# Altium schematic sheet Sheet2.SchDoc
size A4; SheetNumber: 2; SheetTotal: 2
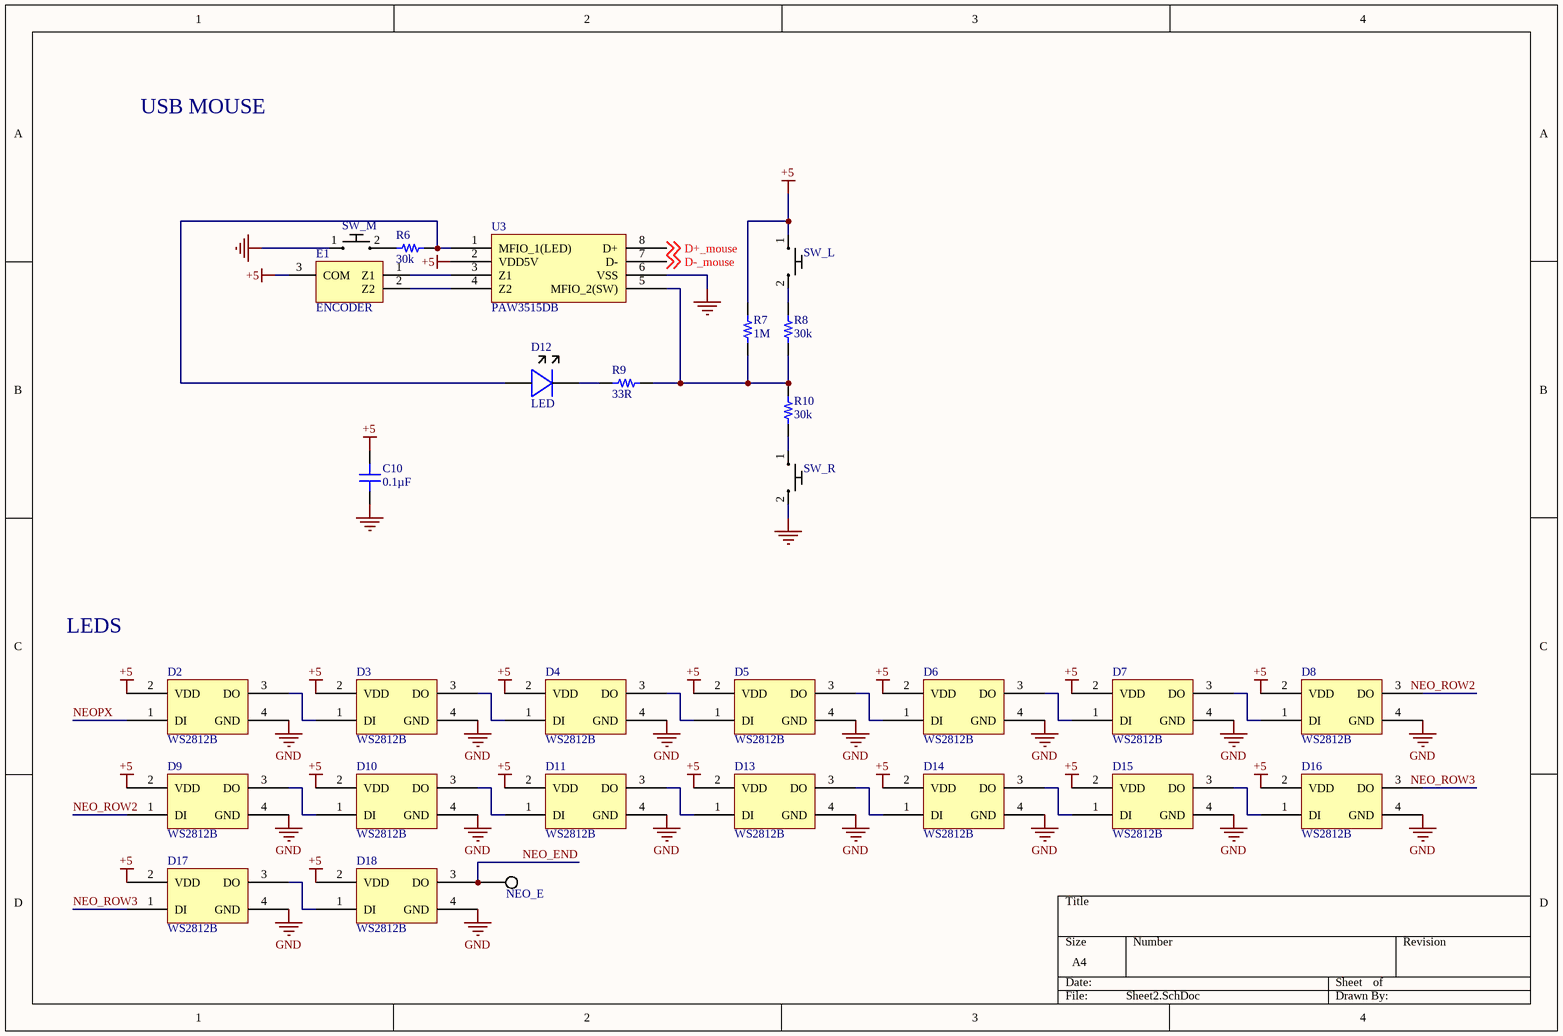
[diagram p0: Sheet2.SchDoc]

## Parts
C10  0.1µF  [CAP 0603_1608]
D2  WS2812B  [WS2812B4020]
D3  WS2812B  [WS2812B4020]
D4  WS2812B  [WS2812B4020]
D5  WS2812B  [WS2812B4020]
D6  WS2812B  [WS2812B4020]
D7  WS2812B  [WS2812B4020]
D8  WS2812B  [WS2812B4020]
D9  WS2812B  [WS2812B4020]
D10  WS2812B  [WS2812B4020]
D11  WS2812B  [WS2812B4020]
D12  LED  [MOUSE_LED]
D13  WS2812B  [WS2812B4020]
D14  WS2812B  [WS2812B4020]
D15  WS2812B  [WS2812B4020]
D16  WS2812B  [WS2812B4020]
D17  WS2812B  [WS2812B4020]
D18  WS2812B  [WS2812B4020]
E1  ENCODER  [TTC_ENCODER]
NEO_E  TestPoint  [TP2020]  (value not drawn)
R6  30k  [RES 0603_1608]
R7  1M  [RES 0603_1608]
R8  30k  [RES 0603_1608]
R9  33R  [RES 0603_1608]
R10  30k  [RES 0603_1608]
SW_L  SPST_BUTTON  [KailhBtn]  (value not drawn)
SW_M  SPST_BUTTON  [KailhBtn]  (value not drawn)
SW_R  SPST_BUTTON  [KailhBtn]  (value not drawn)
U3  PAW3515DB  [PAW3515DB]

## Nets
+5: C10.2 D2.2(VDD) D3.2(VDD) D4.2(VDD) D5.2(VDD) D6.2(VDD) D7.2(VDD) D8.2(VDD) D9.2(VDD) D10.2(VDD) D11.2(VDD) D13.2(VDD) D14.2(VDD) D15.2(VDD) D16.2(VDD) D17.2(VDD) D18.2(VDD) E1.3(COM) R7.2 SW_L.1 U3.2(VDD5V)
GND: C10.1 D2.4(GND) D3.4(GND) D4.4(GND) D5.4(GND) D6.4(GND) D7.4(GND) D8.4(GND) D9.4(GND) D10.4(GND) D11.4(GND) D13.4(GND) D14.4(GND) D15.4(GND) D16.4(GND) D17.4(GND) D18.4(GND) SW_M.1 SW_R.2 U3.6(VSS)
D+_mouse: U3.8(D+) ; off-sheet D+_mouse
D-_mouse: U3.7(D-) ; off-sheet D-_mouse
NEO_END: D18.3(DO) NEO_E.TP
NEO_ROW2: D8.3(DO) D9.1(DI)
NEO_ROW3: D16.3(DO) D17.1(DI)
NEOPX: D2.1(DI)
NetD2_3: D2.3(DO) D3.1(DI)
NetD3_3: D3.3(DO) D4.1(DI)
NetD4_3: D4.3(DO) D5.1(DI)
NetD5_3: D5.3(DO) D6.1(DI)
NetD6_3: D6.3(DO) D7.1(DI)
NetD7_3: D7.3(DO) D8.1(DI)
NetD9_3: D9.3(DO) D10.1(DI)
NetD10_3: D10.3(DO) D11.1(DI)
NetD11_3: D11.3(DO) D13.1(DI)
NetD12_A: D12.A R6.2 U3.1(MFIO_1(LED))
NetD12_K: D12.K R9.1
NetD13_3: D13.3(DO) D14.1(DI)
NetD14_3: D14.3(DO) D15.1(DI)
NetD15_3: D15.3(DO) D16.1(DI)
NetD17_3: D17.3(DO) D18.1(DI)
NetE1_1: E1.1(Z1) U3.3(Z1)
NetE1_2: E1.2(Z2) U3.4(Z2)
NetR6_1: R6.1 SW_M.2
NetR7_1: R7.1 R8.1 R9.2 R10.2 U3.5(MFIO_2(SW))
NetR8_2: R8.2 SW_L.2
NetR10_1: R10.1 SW_R.1

## Notes on the sheet
- USB MOUSE
- LEDS

## Library data of the parts
C10 = CAP-RTZP49: CAP CER SMD 0603 .1UF 10% X7R 25; Manufacturer: Samsung Electro-Mechanics; Rated Voltage: 50V; Part Number: CAP-RTZP49; SCH_Comment: 0.1µF; Value: 0.1µF; Tolerance: ±10%; Supplier 1: Digi-key; Supplier Part Number 1: 1276-CL10B104KB8NNNLCT-ND; JLC PartNumber: C14663; Size: 0603 (1608 Metric)
D2-D11 D13-D18 = DIO4020-RYIG4M: NEOPIXEL RGB LED; Manufacturer: Worldsemi; Part Number: DIO4020-RYIG4M; SCH_Comment: WS2812B; Supplier 1: LCSC; JLC PartNumber: C3647024; Supplier Part Number 1: C2761795
D12 = Optical mouse diode: Part Number: Optical mouse diode; SCH_Comment: Optical mouse diode
E1 = MouseEncoder: Mouse wheel encoder; SCH_Comment: MSENC; Part Number: MouseEncoder; Supplier 1: Aliexpress; Supplier Part Number 1: https://fr.aliexpress.com/item/1005007019311898.html
NEO_E = JMP-RTZL7I: PC TEST POINT MINIATURE; Manufacturer: Keystone Electronics; SCH_Comment: 5015 TestPoint; Part Number: JMP-RTZL7I; Supplier 1: DigiKey; Supplier Part Number 1: 36-5015TR-ND
R6 R8 R10 = ERJ-3EKF3002V: RES SMD 30K OHM 1% 1/10W 0603; Manufacturer: Panasonic Electronic Components; Power (Watts): 0.1W, 1/10W; Temperature Coefficient: ±100ppm/°C; Part Number: ERJ-3EKF3002V; SCH_Comment: 30k; Value: 30k; Tolerance: ±1%; Supplier 1: Digi-key; Supplier Part Number 1: P30.0KHCT-ND; Composition: Thick Film; Features: Automotive AEC-Q200; Operating Temperature: -55°C ~ 155°C; Size: 0603 (1608 Metric)
R7 = ERJ-3EKF1004V: RES SMD 1M OHM 1% 1/10W 0603; Manufacturer: Panasonic Electronic Components; Power (Watts): 0.1W, 1/10W; Temperature Coefficient: ±100ppm/°C; Part Number: ERJ-3EKF1004V; SCH_Comment: 1M; Value: 1M; Tolerance: ±1%; Supplier 1: Digi-key; Supplier Part Number 1: P1.00MHCT-ND; Composition: Thick Film; Features: Automotive AEC-Q200; Operating Temperature: -55°C ~ 155°C; Size: 0603 (1608 Metric)
R9 = ERJ-3EKF33R0V: RES SMD 33 OHM 1% 1/10W 0603; Manufacturer: Panasonic Electronic Components; Value: 33; Power (Watts): 0.1W, 1/10W; Temperature Coefficient: ±100ppm/°C; Part Number: ERJ-3EKF33R0V; SCH_Comment: 33R; Tolerance: ±1%; Supplier 1: Digi-key; Supplier Part Number 1: P33.0HCT-ND; Composition: Thick Film; Features: Automotive AEC-Q200; Operating Temperature: -55°C ~ 155°C; Size: 0603 (1608 Metric)
SW_L SW_M SW_R = MouseClickBtn: Bouton of mouse click; SCH_Comment: MSBTN; Part Number: MouseClickBtn; Supplier 1: Aliexpress; Supplier Part Number 1: https://fr.aliexpress.com/item/1005005271018166.html
U3 = PAW3515DB: Optical mouse sensor; Part Number: PAW3515DB; SCH_Comment: PAW3515DB; Supplier 1: Aliexpress; Supplier Part Number 1: https://fr.aliexpress.com/item/4001098948441.html